# Altium schematic sheet 04-Sensors.SchDoc
size A4
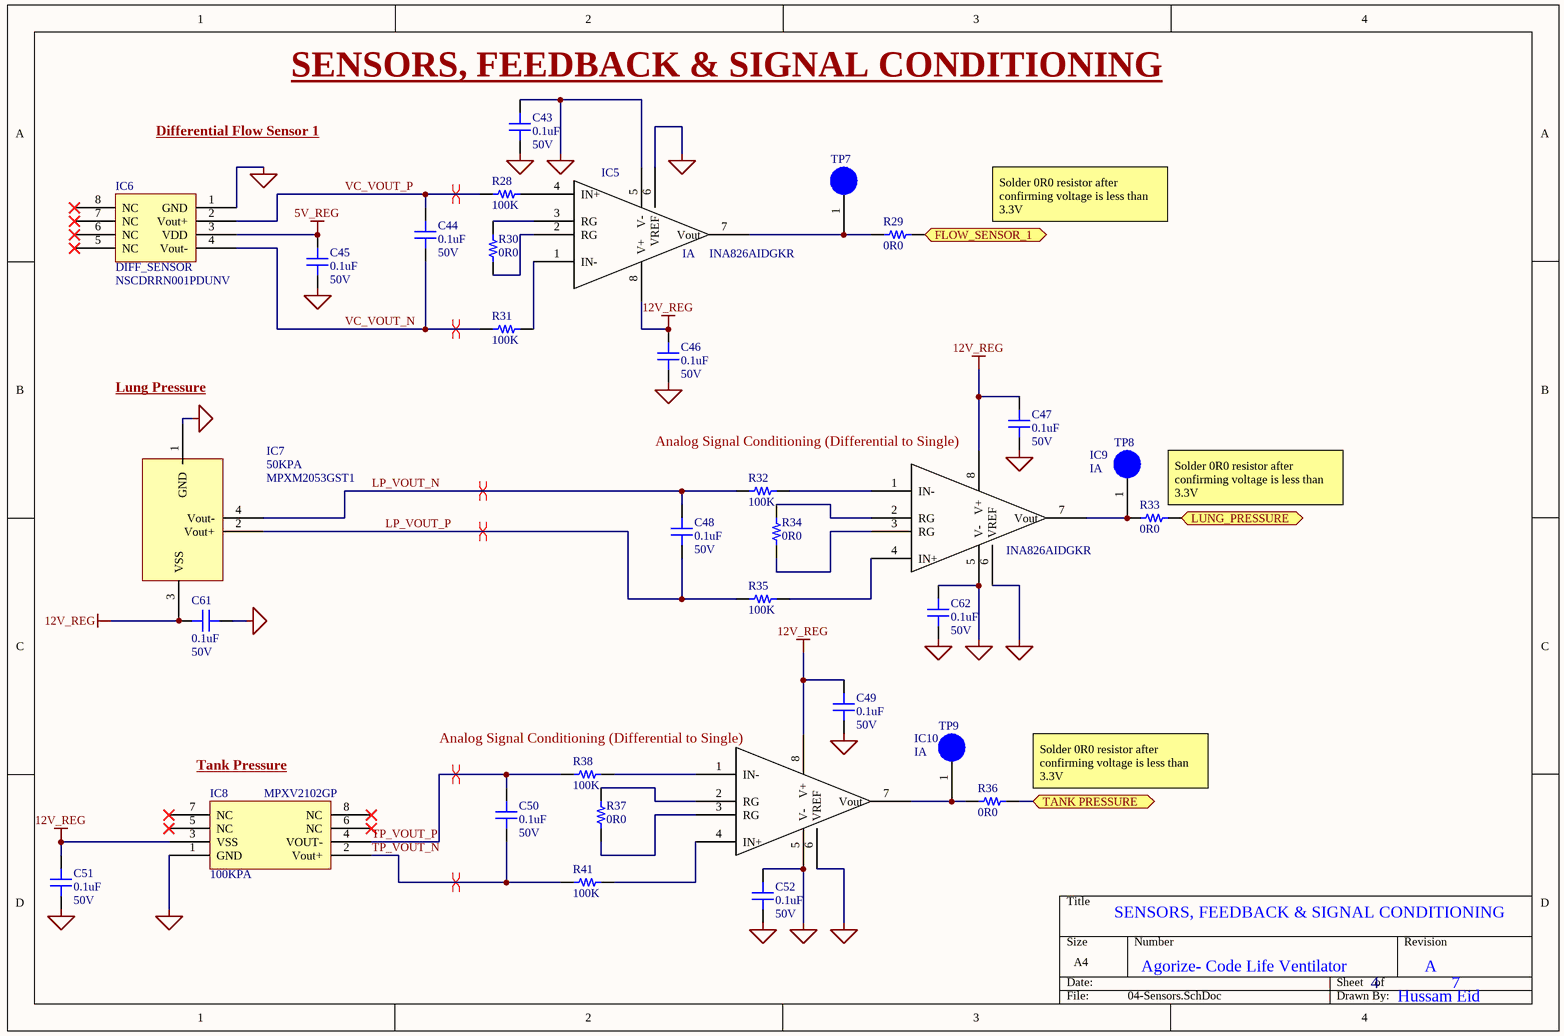
[diagram p0: 04-Sensors.SchDoc]

## Parts
C43  0.1uF  Voltage Rating: 50V  [CAP 0603/1608]
C44  0.1uF  Voltage Rating: 50V  [CAP 0603/1608]
C45  0.1uF  Voltage Rating: 50V  [CAP 0603/1608]
C46  0.1uF  Voltage Rating: 50V  [CAP 0603/1608]
C47  0.1uF  Voltage Rating: 50V  [CAP 0603/1608]
C48  0.1uF  Voltage Rating: 50V  [CAP 0603/1608]
C49  0.1uF  Voltage Rating: 50V  [CAP 0603/1608]
C50  0.1uF  Voltage Rating: 50V  [CAP 0603/1608]
C51  0.1uF  Voltage Rating: 50V  [CAP 0603/1608]
C52  0.1uF  Voltage Rating: 50V  [CAP 0603/1608]
C61  0.1uF  Voltage Rating: 50V  [CAP 0603/1608]
C62  0.1uF  Voltage Rating: 50V  [CAP 0603/1608]
IC5  IA  Manufacturer Part Number 1: INA826AIDGKR  [SOP65P490X110-8N]
IC6  DIFF_SENSOR  Manufacturer Part Number 1: NSCDRRN001PDUNV  [DIP8_Pressure_Sense]
IC7  50KPA  Manufacturer Part Number 1: MPXM2053GST1  [DPAK127P1219X1008-5N]
IC8  100KPA  Manufacturer Part Number 1: MPXV2102GP  [SOP127P600-8N]
IC9  IA  Manufacturer Part Number 1: INA826AIDGKR  [SOP65P490X110-8N]
IC10  IA  [SOP65P490X110-8N]
R28  100K  [RES 0603/1608]
R29  0R0  [RES 0603/1608]
R30  0R0  [RES 0603/1608]
R31  100K  [RES 0603/1608]
R32  100K  [RES 0603/1608]
R33  0R0  [RES 0603/1608]
R34  0R0  [RES 0603/1608]
R35  100K  [RES 0603/1608]
R36  0R0  [RES 0603/1608]
R37  0R0  [RES 0603/1608]
R38  100K  [RES 0603/1608]
R41  100K  [RES 0603/1608]
TP7  TP  [TP]  (value not drawn)
TP8  TP  [TP]  (value not drawn)
TP9  TP  [TP]  (value not drawn)

## Ports
FLOW_SENSOR_1 (bidir), LUNG_PRESSURE (bidir), TANK PRESSURE (bidir)

## Nets
5V_REG: C45.1 IC6.3(VDD)
12V_REG: C46.2 C47.2 C49.2 C51.2 C61.1 IC5.8(V+) IC7.3(VSS) IC8.3(VSS) IC9.8(V+) IC10.8(V+)
COM: C43.1 C43.2 C45.2 C46.1 C47.1 C49.1 C51.1 C52.1 C52.2 C61.2 C62.1 C62.2 IC5.5(V-) IC5.6(VREF) IC6.1(GND) IC7.1(GND) IC8.1(GND) IC9.5(V-) IC9.6(VREF) IC10.5(V-) IC10.6(VREF)
FLOW_SENSOR_1: R29.1 ; port FLOW_SENSOR_1
LP_VOUT_N: C48.2 IC7.4(Vout-) R32.2
LP_VOUT_P: C48.1 IC7.2(Vout+) R35.2
LUNG_PRESSURE: R33.1 ; port LUNG_PRESSURE
TANK PRESSURE: R36.1 ; port TANK PRESSURE
TP_VOUT_N: C50.1 IC8.2(Vout+) R41.2
TP_VOUT_P: C50.2 IC8.4(VOUT-) R38.2
VC_VOUT_N: C44.1 IC6.4(Vout-) R31.2
VC_VOUT_P: C44.2 IC6.2(Vout+) R28.2
NetIC5_1: IC5.1(IN-) R31.1
NetIC5_2: IC5.2(RG) R30.1
NetIC5_3: IC5.3(RG) R30.2
NetIC5_4: IC5.4(IN+) R28.1
NetIC5_7: IC5.7(Vout) R29.2 TP7.1
NetIC9_1: IC9.1(IN-) R32.1
NetIC9_2: IC9.2(RG) R34.2
NetIC9_3: IC9.3(RG) R34.1
NetIC9_4: IC9.4(IN+) R35.1
NetIC9_7: IC9.7(Vout) R33.2 TP8.1
NetIC10_1: IC10.1(IN-) R38.1
NetIC10_2: IC10.2(RG) R37.2
NetIC10_3: IC10.3(RG) R37.1
NetIC10_4: IC10.4(IN+) R41.1
NetIC10_7: IC10.7(Vout) R36.2 TP9.1

Not connected (* = marked no-connect by the designer): IC6 5(NC)* 6(NC)* 7(NC)* 8(NC)*; IC8 5(NC)* 6(NC)* 7(NC)* 8(NC)*

## Layout directives
differential pair: LP_VOUT_N, LP_VOUT_P, TP_VOUT_N, TP_VOUT_P, VC_VOUT_N, VC_VOUT_P

## Notes on the sheet
- (near C43) SENSORS, FEEDBACK & SIGNAL CONDITIONING
- Differential Flow Sensor 1
- Solder 0R0 resistor after confirming voltage is less than 3.3V
- Lung Pressure
- (near C47) Analog Signal Conditioning (Differential to Single)
- (near R33) Solder 0R0 resistor after confirming voltage is less than 3.3V
- (near IC8) Tank Pressure
- Analog Signal Conditioning (Differential to Single)
- (near R36) Solder 0R0 resistor after confirming voltage is less than 3.3V
- SENSORS, FEEDBACK & SIGNAL CONDITIONING
- Agorize- Code Life Ventilator
- 4
- A
- 7
- Hussam Eid

## Library data of the parts
C43-C52 C61 C62 = C1608X7R1E104K080AA: CAP CER 0.1UF 50V X7R 0603; Manufacturer 1: KEMET; Manufacturer Part Number 1: C0603C104M5RACTU; Description 1: Cap Ceramic 0.1uF 50V X7R 20% SMD 0603 125C T/R; Dielectric Material: Ceramic; Capacitance: 100nF; Tolerance: 20%; Dissipation Factor: 2.5%; ComponentLink1Description: Datasheet; ComponentLink1URL: https://product.tdk.com/info/en/catalog/datasheets/mlcc_commercial_general_en.pdf; ComponentLink2Description: Digi-Key listing; ComponentLink2URL: http://digikey.com/product-detail/en/C1608X7R1E104K080AA/445-1316-1-ND/567697; Supplier 1: Digi-Key; Supplier Part Number 1: 399-7845-1-ND; RoHS 1: Yes; Stock 1: 3475152; Pricing 1: 1 = 0.10000, 10 = 0.03900, 100 = 0.01740, 500 = 0.01240, 1000 = 0.00974 (USD); Mount: Surface Mount,PCB; Case/Package: 0603; Contact Plating: Tin,Matte; Case Code (Metric): 1608; Case Code (Imperial): 0603; Min Operating Temperature: -55°C; Max Operating Temperature: 125°C; Dielectric: X7R; Termination: SMD/SMT; Package Quantity: 1; Packaging: Tape and Reel; Voltage Rating (DC): 50V; Length: 1.6mm; Height: 0.8mm; Thickness: 0.034inch; Lead Pitch: 0.7mm; Depth: 0.8mm; Width: 0.031inch; Radiation Hardening: No; REACH SVHC: No SVHC; ComponentLink3URL: https://www.verical.com/server-webapp/html/getDatasheet?partID=626892&src-supplier=Verical; ComponentLink3Description: https://www.verical.com/server-webapp/html/getDatasheet?partID=626892&src-supplier=Verical; ComponentLink4URL: http://www.farnell.com/datasheets/2746056.pdf?src-supplier=Farnell; ComponentLink4Description: http://www.farnell.com/datasheets/2746056.pdf?src-supplier=Farnell; ComponentLink5URL: http://components.arrow.com/part/dataview/0323_00313986?src-supplier=Arrow+Europe; ComponentLink5Description: http://components.arrow.com/part/dataview/0323_00313986?src-supplier=Arrow+Europe; ComponentLink6URL: http://www.mouser.com/ds/2/212/KEM_C1002_X7R_SMD-1102033.pdf?src-supplier=Mouser; ComponentLink6Description: http://www.mouser.com/ds/2/212/KEM_C1002_X7R_SMD-1102033.pdf?src-supplier=Mouser; ComponentLink7URL: http://www.alliedelec.com/m/d/6f3b5eb83d09db50ed28bdc730567b33.pdf?src-supplier=Allied+Electronics; ComponentLink7Description: http://www.alliedelec.com/m/d/6f3b5eb83d09db50ed28bdc730567b33.pdf?src-supplier=Allied+Electronics; ComponentLink8URL: http://components.arrow.com/part/dataview/40911037S8853915N7429?src-supplier=Arrow; ComponentLink8Description: http://components.arrow.com/part/dataview/40911037S8853915N7429?src-supplier=Arrow; ComponentLink9URL: http://www.farnell.com/datasheets/2746056.pdf?src-supplier=Newark; ComponentLink9Description: http://www.farnell.com/datasheets/2746056.pdf?src-supplier=Newark; ComponentLink10URL: http://www.farnell.com/datasheets/1828800.pdf?src-supplier=Newark; ComponentLink10Description: http://www.farnell.com/datasheets/1828800.pdf?src-supplier=Newark; ComponentLink11URL: http://capacitoredge.kemet.com/capedge2/DataSheet?pn=C0603C104M5RAC7867&src-supplier=Avnet+Asia; ComponentLink11Description: http://capacitoredge.kemet.com/capedge2/DataSheet?pn=C0603C104M5RAC7867&src-supplier=Avnet+Asia; ComponentLink12URL: https://api.kemet.com/component-edge/download/datasheet/C0603C104M5RACTU.pdf?src-supplier=Digi-Key; ComponentLink12Description: https://api.kemet.com/component-edge/download/datasheet/C0603C104M5RACTU.pdf?src-supplier=Digi-Key; ComponentLink13URL: https://www.verical.com/server-webapp/html/getDatasheet?partID=110138&src-supplier=Verical; ComponentLink13Description: https://www.verical.com/server-webapp/html/getDatasheet?partID=110138&src-supplier=Verical; ComponentLink14URL: http://capacitoredge.kemet.com/capedge2/DataSheet?pn=C0603C104M5RAC7867&src-supplier=Avnet; ComponentLink14Description: http://capacitoredge.kemet.com/capedge2/DataSheet?pn=C0603C104M5RAC7867&src-supplier=Avnet; ComponentLink15URL: http://www.farnell.com/datasheets/2315113.pdf?src-supplier=Newark; ComponentLink15Description: http://www.farnell.com/datasheets/2315113.pdf?src-supplier=Newark; ComponentLink16URL: http://www.farnell.com/datasheets/2746056.pdf?src-supplier=Element14; ComponentLink16Description: http://www.farnell.com/datasheets/2746056.pdf?src-supplier=Element14
IC5 IC9 = IA: IC INST AMP 1 CIRCUIT 8VSSOP; Manufacturer 1: Texas Instruments; Description 1: TEXAS INSTRUMENTS - INA826AIDGKR - ?????, 1????, 40 µV, 1 V/µs, 1 MHz, 2.7V ? 36V, ± 1.35V ? ± 18V, VSSOP; Common Mode Rejection Ratio: 84dB; Number of Channels: 1; Max Supply Voltage: 36V; Min Supply Voltage: 2.7V; Quiescent Current: 200uA; Input Bias Current: 65nA; Input Offset Voltage (Vos): 150uV; Input Voltage Noise Density: 18nV/sqrt Hz; Output Current per Channel: 16mA; Power Supply Rejection Ratio (PSRR): 100dB; Voltage Gain: 60dB; Input Resistance: 100kR; Slew Rate: 1V/µs; -3db Bandwidth: 1MHz; Min Dual Supply Voltage: 1.35V; Max Dual Supply Voltage: 18V; Supplier 1: Digi-Key; Supplier Part Number 1: 296-29663-1-ND; RoHS 1: Yes; Stock 1: 17777; Pricing 1: 1 = 2.73000, 10 = 2.44900, 25 = 2.31000, 100 = 1.84800, 250 = 1.61700, 500 = 1.57080, 1000 = 1.24740 (USD); Case/Package: VSSOP; Number of Pins: 8; Weight: 0.000935oz; Contact Plating: Gold; Min Operating Temperature: -40°C; Max Operating Temperature: 125°C; Operating Supply Current: 200uA; Number of Circuits: 1; Number of Elements: 1; Number of Amplifiers: 1; Packaging: Tape and Reel; Bandwidth: 1MHz; Package Quantity: 2500; Radiation Hardening: No; REACH SVHC: No SVHC; Lead Free: Lead Free; ComponentLink1URL: https://datasheet.ciiva.com/1487/1806064-1487618.pdf?src-supplier=Element14; ComponentLink1Description: https://datasheet.ciiva.com/1487/1806064-1487618.pdf?src-supplier=Element14; ComponentLink2URL: https://datasheet.ciiva.com/1798/ina826-1798294.pdf?src-supplier=Digi-Key; ComponentLink2Description: https://datasheet.ciiva.com/1798/ina826-1798294.pdf?src-supplier=Digi-Key; ComponentLink3URL: https://datasheet.ciiva.com/1798/ina826-1798295.pdf?src-supplier=Digi-Key; ComponentLink3Description: https://datasheet.ciiva.com/1798/ina826-1798295.pdf?src-supplier=Digi-Key; ComponentLink4URL: https://datasheet.ciiva.com/1798/ina826-1798296.pdf?src-supplier=Digi-Key; ComponentLink4Description: https://datasheet.ciiva.com/1798/ina826-1798296.pdf?src-supplier=Digi-Key; ComponentLink5URL: https://datasheet.ciiva.com/14338/ina826-14338024.pdf?src-supplier=Avnet; ComponentLink5Description: https://datasheet.ciiva.com/14338/ina826-14338024.pdf?src-supplier=Avnet
IC6 = DIFF_SENSOR: SENSOR PRESS DIFF 1PSI; Manufacturer 1: Honeywell Sensing & Control; Description 1: SENSOR, 1PSI, DIP, DUAL RADIAL, DIFF; Output Type: Analog; Pressure Type: Differential; Accuracy: 0.25%; Max Supply Current: 2mA; Voltage Rating (DC): 5V; Port Style: Barbed; Min Supply Voltage: 1.8V; Max Supply Voltage: 12V; Nominal Supply Current: 1.5mA; Interface: I2C; Supplier 1: Digi-Key; Supplier Part Number 1: 480-3640-ND; RoHS 1: Yes; Stock 1: 436; Pricing 1: 1 = 18.47000, 10 = 16.67100, 25 = 15.97200, 50 = 14.97380, 100 = 14.52000 (USD); Mount: Through Hole; Case/Package: DIP; Number of Pins: 8; Min Operating Temperature: -40°C; Max Operating Temperature: 85°C; Operating Pressure: 1PSI; Termination: PC Pin; Operating Supply Voltage: 5V; Voltage Rating: 5V; Max Supply Voltage (DC): 12V; Min Supply Voltage (DC): 1.8V; Package Quantity: 20; Length: 10mm; Height: 6.16mm; Width: 6.99mm; REACH SVHC: No SVHC; ComponentLink1URL: https://datasheet.ciiva.com/15705/hwscs06435-1-15705079.pdf?src-supplier=Onlinecomponents.com; ComponentLink1Description: https://datasheet.ciiva.com/15705/hwscs06435-1-15705079.pdf?src-supplier=Onlinecomponents.com; ComponentLink2URL: https://datasheet.ciiva.com/16832/70338091-16832686.pdf?src-supplier=Allied+Electronics; ComponentLink2Description: https://datasheet.ciiva.com/16832/70338091-16832686.pdf?src-supplier=Allied+Electronics; ComponentLink3URL: https://datasheet.ciiva.com/1318/1499905-1318108.pdf?src-supplier=Element14; ComponentLink3Description: https://datasheet.ciiva.com/1318/1499905-1318108.pdf?src-supplier=Element14
IC7 = Pressure Sensor: SENS PRESSURE 7.25 PSI MAX MPAK; Manufacturer 1: NXP Freescale; Description 1: Pressure Sensor 0V to 0.04V 0kPa to 50kPa Absolute Automotive 5-Pin(4+Tab) M-PAC T/R; Output Type: Wheatstone Bridge; Pressure Type: Vented Gauge; Operating Supply Voltage: 10V; Max Supply Voltage: 16V; Nominal Supply Current: 6mA; Output Voltage: 40mV; Accuracy: 0.4%; Port Style: Barbless; Max Pressure: 29.01PSI; Supplier 1: Digi-Key; Supplier Part Number 1: 568-13748-1-ND; RoHS 1: Yes; Stock 1: 1331; Pricing 1: 1 = 11.78000, 5 = 10.33200, 10 = 9.29900, 25 = 8.26600, 50 = 7.64600, 100 = 6.61270 (USD); Mount: Surface Mount; Case/Package: SMD/SMT; Weight: 0.018618oz; Min Operating Temperature: -40°C; Max Operating Temperature: 125°C; Packaging: Tape and Reel; Package Quantity: 400; Operating Pressure: 7.25PSI; Termination: PCB; Lead Free: Lead Free; Halogen Free: Halogen Free; ComponentLink1URL: https://datasheet.ciiva.com/3272/mpx2053-3272653.pdf?src-supplier=Avnet; ComponentLink1Description: https://datasheet.ciiva.com/3272/mpx2053-3272653.pdf?src-supplier=Avnet; ComponentLink2URL: https://datasheet.ciiva.com/2843/mpx2053-2843368.pdf?src-supplier=Digi-Key; ComponentLink2Description: https://datasheet.ciiva.com/2843/mpx2053-2843368.pdf?src-supplier=Digi-Key; ComponentLink3URL: https://datasheet.ciiva.com/16463/mpx2053-16463915.pdf?src-supplier=Future+Electronics; ComponentLink3Description: https://datasheet.ciiva.com/16463/mpx2053-16463915.pdf?src-supplier=Future+Electronics
IC8 = 100KPA Pressure Sensor: SENSOR GAUGE PRESS 14.5PSI MAX; Manufacturer 1: NXP Freescale; Description 1: Pressure Sensor 14.5 PSI (100 kPa) Vented Gauge Male - 0.13" (3.17mm) Tube 0 mV ~ 40 mV (10V) 8-SMD Module; Operating Supply Voltage: 10V; Max Supply Voltage: 16V; Nominal Supply Current: 6mA; Port Style: Barbed; Max Pressure: 58.02PSI; Accuracy: 0.5%; Output Voltage: 40mV; Output Type: Wheatstone Bridge; Pressure Type: Vented Gauge; Supplier 1: Digi-Key; Supplier Part Number 1: MPXV2102GP-ND; RoHS 1: Yes; Stock 1: 406; Pricing 1: 1 = 13.86000, 5 = 13.57400, 10 = 11.31200, 25 = 10.46360, 50 = 10.18080, 100 = 8.76680, 500 = 8.20120, 1000 = 7.77700, 5000 = 7.21140 (USD); Mount: Surface Mount; Case/Package: SOP; Number of Pins: 8; Weight: 0.061909oz; Min Operating Temperature: -40°C; Max Operating Temperature: 125°C; Packaging: Tray; Package Quantity: 125; Operating Pressure: 14.5PSI; Termination: PCB; Voltage Rating (DC): 10V; Lead Free: Lead Free; Halogen Free: Halogen Free; ComponentLink1URL: https://datasheet.ciiva.com/3272/mpx2102-3272661.pdf?src-supplier=Avnet; ComponentLink1Description: https://datasheet.ciiva.com/3272/mpx2102-3272661.pdf?src-supplier=Avnet; ComponentLink2URL: https://datasheet.ciiva.com/26022/mpx2102-26022587.pdf?src-supplier=Avnet+Europe; ComponentLink2Description: https://datasheet.ciiva.com/26022/mpx2102-26022587.pdf?src-supplier=Avnet+Europe; ComponentLink3URL: https://datasheet.ciiva.com/2843/mpx2102-2843513.pdf?src-supplier=Digi-Key; ComponentLink3Description: https://datasheet.ciiva.com/2843/mpx2102-2843513.pdf?src-supplier=Digi-Key
IC10 = IA: IC INST AMP 1 CIRCUIT 8VSSOP; Manufacturer 1: Texas Instruments; Manufacturer Part Number 1: INA826AIDGKR; Description 1: TEXAS INSTRUMENTS - INA826AIDGKR - ?????, 1????, 40 µV, 1 V/µs, 1 MHz, 2.7V ? 36V, ± 1.35V ? ± 18V, VSSOP; Common Mode Rejection Ratio: 84dB; Number of Channels: 1; Max Supply Voltage: 36V; Min Supply Voltage: 2.7V; Quiescent Current: 200uA; Input Bias Current: 65nA; Input Offset Voltage (Vos): 150uV; Input Voltage Noise Density: 18nV/sqrt Hz; Output Current per Channel: 16mA; Power Supply Rejection Ratio (PSRR): 100dB; Voltage Gain: 60dB; Input Resistance: 100kR; Slew Rate: 1V/µs; -3db Bandwidth: 1MHz; Min Dual Supply Voltage: 1.35V; Max Dual Supply Voltage: 18V; Supplier 1: Digi-Key; Supplier Part Number 1: 296-29663-1-ND; RoHS 1: Yes; Stock 1: 17777; Pricing 1: 1 = 2.73000, 10 = 2.44900, 25 = 2.31000, 100 = 1.84800, 250 = 1.61700, 500 = 1.57080, 1000 = 1.24740 (USD); Case/Package: VSSOP; Number of Pins: 8; Weight: 0.000935oz; Contact Plating: Gold; Min Operating Temperature: -40°C; Max Operating Temperature: 125°C; Operating Supply Current: 200uA; Number of Circuits: 1; Number of Elements: 1; Number of Amplifiers: 1; Packaging: Tape and Reel; Bandwidth: 1MHz; Package Quantity: 2500; Radiation Hardening: No; REACH SVHC: No SVHC; Lead Free: Lead Free; ComponentLink1URL: https://datasheet.ciiva.com/1487/1806064-1487618.pdf?src-supplier=Element14; ComponentLink1Description: https://datasheet.ciiva.com/1487/1806064-1487618.pdf?src-supplier=Element14; ComponentLink2URL: https://datasheet.ciiva.com/1798/ina826-1798294.pdf?src-supplier=Digi-Key; ComponentLink2Description: https://datasheet.ciiva.com/1798/ina826-1798294.pdf?src-supplier=Digi-Key; ComponentLink3URL: https://datasheet.ciiva.com/1798/ina826-1798295.pdf?src-supplier=Digi-Key; ComponentLink3Description: https://datasheet.ciiva.com/1798/ina826-1798295.pdf?src-supplier=Digi-Key; ComponentLink4URL: https://datasheet.ciiva.com/1798/ina826-1798296.pdf?src-supplier=Digi-Key; ComponentLink4Description: https://datasheet.ciiva.com/1798/ina826-1798296.pdf?src-supplier=Digi-Key; ComponentLink5URL: https://datasheet.ciiva.com/14338/ina826-14338024.pdf?src-supplier=Avnet; ComponentLink5Description: https://datasheet.ciiva.com/14338/ina826-14338024.pdf?src-supplier=Avnet
R28 R31 R32 R35 R38 R41 = ERJ-3EKF1001V: RES SMD100K OHM 0.5% 1/16W 0603; Manufacturer 1: Susumu; Manufacturer Part Number 1: RR0816P-104-D; Max Power Dissipation: 63mW; Voltage Rating (DC): 75V; Resistance: 100kR; Temperature Coefficient: 25ppm/°C; ComponentLink7URL: https://datasheet.ciiva.com/28695/1678796-28695833.pdf?src-supplier=Element14; ComponentLink7Description: https://datasheet.ciiva.com/28695/1678796-28695833.pdf?src-supplier=Element14; ComponentLink8URL: https://datasheet.ciiva.com/5959/1678796-5959707.pdf?src-supplier=Farnell; ComponentLink8Description: https://datasheet.ciiva.com/5959/1678796-5959707.pdf?src-supplier=Farnell; ComponentLink9URL: https://datasheet.ciiva.com/46377/1678796-46377868.pdf?src-supplier=Element14; ComponentLink9Description: https://datasheet.ciiva.com/46377/1678796-46377868.pdf?src-supplier=Element14; ComponentLink10URL: https://datasheet.ciiva.com/9198/aoa0000ce1-9198975.pdf?src-supplier=Avnet; ComponentLink10Description: https://datasheet.ciiva.com/9198/aoa0000ce1-9198975.pdf?src-supplier=Avnet; ComponentLink11URL: https://datasheet.ciiva.com/16758/70255313-16758527.pdf?src-supplier=Allied+Electronics; ComponentLink11Description: https://datasheet.ciiva.com/16758/70255313-16758527.pdf?src-supplier=Allied+Electronics; ComponentLink12URL: https://datasheet.ciiva.com/16834/aoa0000ce1-16834828.pdf?src-supplier=Future+Electronics; ComponentLink12Description: https://datasheet.ciiva.com/16834/aoa0000ce1-16834828.pdf?src-supplier=Future+Electronics; ComponentLink13URL: https://datasheet.ciiva.com/17215/aoa0000ce1-17215388.pdf?src-supplier=Avnet+Europe; ComponentLink13Description: https://datasheet.ciiva.com/17215/aoa0000ce1-17215388.pdf?src-supplier=Avnet+Europe; ComponentLink14URL: https://datasheet.ciiva.com/30199/4aoa0000ce1-30199822.pdf?src-supplier=Onlinecomponents.com; ComponentLink14Description: https://datasheet.ciiva.com/30199/4aoa0000ce1-30199822.pdf?src-supplier=Onlinecomponents.com; ComponentLink1URL: https://datasheet.ciiva.com/11820/0900766b80808d64-11820638.pdf?src-supplier=RSComponents; ComponentLink1Description: https://datasheet.ciiva.com/11820/0900766b80808d64-11820638.pdf?src-supplier=RSComponents; ComponentLink2URL: https://datasheet.ciiva.com/7984/87330-7984341.pdf?src-supplier=Element14; ComponentLink2Description: https://datasheet.ciiva.com/7984/87330-7984341.pdf?src-supplier=Element14; ComponentLink3URL: https://datasheet.ciiva.com/2487/rr-data-sheet-2487067.pdf?src-supplier=Digi-Key; ComponentLink3Description: https://datasheet.ciiva.com/2487/rr-data-sheet-2487067.pdf?src-supplier=Digi-Key; ComponentLink4URL: https://datasheet.ciiva.com/2487/rr-data-sheet-2487068.pdf?src-supplier=Digi-Key; ComponentLink4Description: https://datasheet.ciiva.com/2487/rr-data-sheet-2487068.pdf?src-supplier=Digi-Key; ComponentLink5URL: https://datasheet.ciiva.com/2487/rr-data-sheet-2487069.pdf?src-supplier=Digi-Key; ComponentLink5Description: https://datasheet.ciiva.com/2487/rr-data-sheet-2487069.pdf?src-supplier=Digi-Key; ComponentLink6URL: https://datasheet.ciiva.com/11820/0900766b80808d64-11820394.pdf?src-supplier=RSComponents; ComponentLink6Description: https://datasheet.ciiva.com/11820/0900766b80808d64-11820394.pdf?src-supplier=RSComponents; ComponentLink15URL: https://datasheet.ciiva.com/7984/87330-7984334.pdf?src-supplier=Element14; ComponentLink15Description: https://datasheet.ciiva.com/7984/87330-7984334.pdf?src-supplier=Element14; Supplier 1: Digi-Key; Supplier Part Number 1: RR08P100KDCT-ND; RoHS 1: Yes; Description 1: RES SMD 100K OHM 0.5% 1/16W 0603; Stock 1: 90889; Pricing 1: 1 = 0.10000, 10 = 0.09300, 100 = 0.03580, 1000 = 0.01575, 2500 = 0.01360 (USD); Case/Package: 0603; Number of Pins: 2; Case Code (Imperial): 0603; Case Code (Metric): 1608; Min Operating Temperature: -55°C; Max Operating Temperature: 125°C; Tolerance: 0.5%; Power Rating: 63mW; Voltage Rating: 75V; Packaging: Tape and Reel; Package Quantity: 1; Termination: SMD/SMT; Composition: Thin Film; Number of Terminations: 2; Working Voltage: 75V; Length: 1.6mm; Height: 0.4mm; Width: 0.8mm; Depth: 0.8mm; Lead Free: Lead Free; REACH SVHC: Unknown
R29 R30 R33 R34 R36 R37 = ERJ-3EKF1001V: RES SMD 0 OHM JUMPER 1/10W 0603; Manufacturer 1: Panasonic; Manufacturer Part Number 1: ERJ-3GEY0R00V; Description 1: Res Thick Film 0603 0 Ohm Jumper Molded SMD Punched Carrier T/R; Resistance: 0mR; Power Rating: 100mW; Voltage Rating: 75V; Tolerance: 0%; Voltage Rating (DC): 50V; Temperature Coefficient: 600ppm/°C; ComponentLink1Description: Datasheet; ComponentLink1URL: http://industrial.panasonic.com/www-cgi/jvcr13pz.cgi?E+PZ+3+AOA0002+ERJ3EKF1001V+7+WW; ComponentLink2Description: Digi-Key listing; ComponentLink2URL: http://digikey.com/product-detail/en/ERJ-3EKF1001V/P1.00KHTR-ND/196032; Supplier 1: Digi-Key; Supplier Part Number 1: P0.0GDKR-ND; RoHS 1: Yes; Stock 1: 17444338; Pricing 1: 1 = 0.10000, 10 = 0.03800, 25 = 0.02760, 50 = 0.02120, 100 = 0.01560, 250 = 0.01188, 500 = 0.00950, 1000 = 0.00700 (USD); Mount: Surface Mount; Case/Package: 0603; Contact Plating: Tin; Case Code (Metric): 1608; Case Code (Imperial): 0603; Min Operating Temperature: -55°C; Max Operating Temperature: 155°C; Composition: Thick Film; Packaging: Tape and Reel; Package Quantity: 1; Number of Terminations: 2; Termination: SMD/SMT; Military Standard: Not; Features: Automotive AEC-Q200; Max Power Dissipation: 100mW; Length: 1.6mm; Height: 0.45mm; Width: 0.031inch; Depth: 0.8mm; Radiation Hardening: No; Lead Free: Lead Free; REACH SVHC: No SVHC; ComponentLink3URL: https://datasheet.ciiva.com/27055/1935748-27055113.pdf?src-supplier=Jameco; ComponentLink3Description: https://datasheet.ciiva.com/27055/1935748-27055113.pdf?src-supplier=Jameco; ComponentLink4URL: https://datasheet.ciiva.com/11808/0900766b80f806dd-11808207.pdf?src-supplier=RSComponents; ComponentLink4Description: https://datasheet.ciiva.com/11808/0900766b80f806dd-11808207.pdf?src-supplier=RSComponents; ComponentLink5URL: https://datasheet.ciiva.com/48532/aoa0000ce1-48532165.pdf?src-supplier=Avnet; ComponentLink5Description: https://datasheet.ciiva.com/48532/aoa0000ce1-48532165.pdf?src-supplier=Avnet; ComponentLink6URL: https://datasheet.ciiva.com/43460/1678796-43460647.pdf?src-supplier=Farnell; ComponentLink6Description: https://datasheet.ciiva.com/43460/1678796-43460647.pdf?src-supplier=Farnell; ComponentLink7URL: https://datasheet.ciiva.com/28695/1678796-28695833.pdf?src-supplier=Element14; ComponentLink7Description: https://datasheet.ciiva.com/28695/1678796-28695833.pdf?src-supplier=Element14; ComponentLink8URL: https://datasheet.ciiva.com/5959/1678796-5959707.pdf?src-supplier=Farnell; ComponentLink8Description: https://datasheet.ciiva.com/5959/1678796-5959707.pdf?src-supplier=Farnell; ComponentLink9URL: https://datasheet.ciiva.com/46377/1678796-46377868.pdf?src-supplier=Element14; ComponentLink9Description: https://datasheet.ciiva.com/46377/1678796-46377868.pdf?src-supplier=Element14; ComponentLink10URL: https://datasheet.ciiva.com/9198/aoa0000ce1-9198975.pdf?src-supplier=Avnet; ComponentLink10Description: https://datasheet.ciiva.com/9198/aoa0000ce1-9198975.pdf?src-supplier=Avnet; ComponentLink11URL: https://datasheet.ciiva.com/16758/70255313-16758527.pdf?src-supplier=Allied+Electronics; ComponentLink11Description: https://datasheet.ciiva.com/16758/70255313-16758527.pdf?src-supplier=Allied+Electronics; ComponentLink12URL: https://datasheet.ciiva.com/16834/aoa0000ce1-16834828.pdf?src-supplier=Future+Electronics; ComponentLink12Description: https://datasheet.ciiva.com/16834/aoa0000ce1-16834828.pdf?src-supplier=Future+Electronics; ComponentLink13URL: https://datasheet.ciiva.com/17215/aoa0000ce1-17215388.pdf?src-supplier=Avnet+Europe; ComponentLink13Description: https://datasheet.ciiva.com/17215/aoa0000ce1-17215388.pdf?src-supplier=Avnet+Europe; ComponentLink14URL: https://datasheet.ciiva.com/30199/4aoa0000ce1-30199822.pdf?src-supplier=Onlinecomponents.com; ComponentLink14Description: https://datasheet.ciiva.com/30199/4aoa0000ce1-30199822.pdf?src-supplier=Onlinecomponents.com
TP7-TP9 = TP: Test Point; Manufacturer 1: N/A